# EAGLE design moshimoshi-audio-v2 (EAGLE 7.3.0)
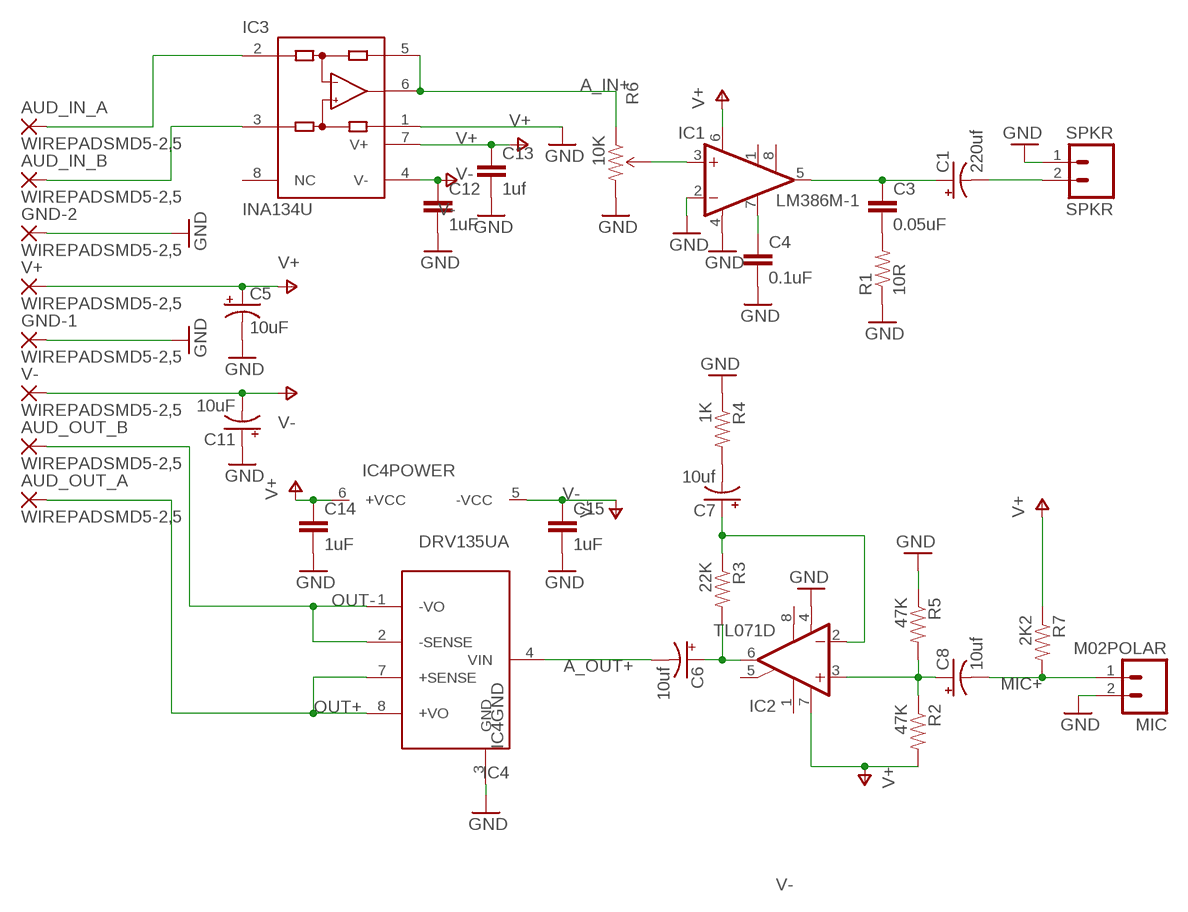
[diagram p0: schematic, sheet 1]

## Parts
AUD_IN_A  WIREPADSMD5-2,5  [5-2,5]
AUD_IN_B  WIREPADSMD5-2,5  [5-2,5]
AUD_OUT_A  WIREPADSMD5-2,5  [5-2,5]
AUD_OUT_B  WIREPADSMD5-2,5  [5-2,5]
C1  220uf  CAP_POLPTH1  [CPOL-RADIAL-100UF-25V]
C3  0.05uF  CAP0805  [0805]
C4  0.1uF  CAP0603-CAP  [0603-CAP]
C5  10uF  10UF-16V-10%(TANT)  [EIA3216]
C6  10uf  CAP_POLPTH2  [CPOL-RADIAL-10UF-25V]
C7  10uf  CAP_POLPTH2  [CPOL-RADIAL-10UF-25V]
C8  10uf  CAP_POLPTH2  [CPOL-RADIAL-10UF-25V]
C11  10uF  10UF-16V-10%(TANT)  [EIA3216]
C12  1uF  CAP0805  [0805]
C13  1uf  CAP0805  [0805]
C14  1uF  CAP0805  [0805]
C15  1uF  CAP0805  [0805]
GND-1  WIREPADSMD5-2,5  [5-2,5]
GND-2  WIREPADSMD5-2,5  [5-2,5]
IC1  LM386M-1  [SO08]
IC2  TL071D  [SO08]
IC3  INA134U  [SO08]
IC4  DRV135UA  [SO08]
MIC  M02POLAR  [MOLEX-1X2]
R1  10R  RESISTOR0805-RES  [0805]
R2  47K  RESISTOR0603-RES  [0603-RES]
R3  22K  RESISTOR0603-RES  [0603-RES]
R4  1K  RESISTOR0603-RES  [0603-RES]
R5  47K  RESISTOR0603-RES  [0603-RES]
R6  10K  TRIMPOT3MM-2  [TRIMPOT-3MM-2]
R7  2K2  RESISTOR0603-RES  [0603-RES]
SPKR  SPKR  M02POLAR  [MOLEX-1X2]
V+  WIREPADSMD5-2,5  [5-2,5]
V-  WIREPADSMD5-2,5  [5-2,5]

## Nets
A_IN+: IC3.5(SENSE) IC3.6(OUT) R6.1(CCW)
A_OUT+: C6.2(-) IC4.4(VIN)
GND: C4.2 C5.C(-) C11.A(+) C12.2 C13.2 C14.2 C15.2 GND-1.1(P) GND-2.1(P) IC1.2(-IN) IC1.4(GND) IC2.4(V-) IC3.1(REF) IC4.3(GND) MIC.2 R1.1 R4.1 R5.1 R6.3(CW) SPKR.1
IN+: AUD_IN_B.1(P) IC3.3(+IN)
IN-: AUD_IN_A.1(P) IC3.2(-IN)
MIC+: C8.2(-) MIC.1 R7.2
N$1: C1.2(-) SPKR.2
N$3: IC1.3(+IN) R6.2(WIPER)
N$4: C1.1(+) C3.1 IC1.5(OUT)
N$5: C4.1 IC1.7(BYPASS)
N$6: C3.2 R1.2
N$8: C6.1(+) IC2.6(OUT) R3.2
N$9: C7.1(+) IC2.2(-IN) R3.1
N$10: C7.2(-) R4.2
N$11: C8.1(+) IC2.3(+IN) R2.1 R5.2
OUT+: AUD_OUT_A.1(P) IC4.7(+SENSE) IC4.8(+VO)
OUT-: AUD_OUT_B.1(P) IC4.1(-VO) IC4.2(-SENSE)
V+: C5.A(+) C13.1 C14.1 IC1.6(VS) IC2.7(V+) IC3.7(V+) IC4.6(+VCC) R2.2 R7.1 V+.1(P)
V-: C11.C(-) C12.1 C15.1 IC3.4(V-) IC4.5(-VCC) V-.1(P)
Unconnected: IC1.1(GAIN) IC1.8(GAIN) IC2.1(ON1) IC2.5(ON2) IC2.8(OPT) IC3.8(NC)

## Library data of the parts
AUD_IN_A AUD_IN_B AUD_OUT_A AUD_OUT_B GND-1 GND-2 V+ V- = wirepad:WIREPAD: Wire PAD connect wire on PCB
C1 C6-C8 = SparkFun-Capacitors:CAP_POL: Capacitor Polarized These are standard SMD and PTH capacitors. Normally 10uF, 47uF, and 100uF in electrolytic and tantalum varieties. Always verify the external diameter of the through hole cap, it varies with capacity, voltage, and manufacturer. The EIA devices should be standard.
C3 C4 C12-C15 = SparkFun-Capacitors:CAP: Capacitor Standard 0603 ceramic capacitor, and 0.1" leaded capacitor.
C5 C11 = SparkFun-Capacitors:10UF-16V-10%(TANT): CAP-00811 1206/EIA-3216 Tantalum capacitor; PROD_ID: CAP-00811
IC1 = linear:LM386?-*: Low Voltage Audio Power Amplifier Source: http://cache.national.com/ds/LM/LM386.pdf
IC2 = linear:TL071: OP AMP
IC3 = burr-brown:INA134: Audio Differential Line Receivers 0dB, G=1; MPN: INA134UAE4; OC_FARNELL: 1206899; OC_NEWARK: 97K1923
IC4 = BurrBrownAudioParts:DRV135: Audio Balanced Line Drivers
MIC SPKR = SparkFun-Connectors:M02: Standard 2-pin 0.1" header. Use with - straight break away headers ( PRT-00116) - right angle break away headers (PRT-00553) - swiss pins (PRT-00743) - machine pins (PRT-00117) - female headers (PRT-00115) Molex polarized connector foot print use with: PRT-08233 with associated crimp pins and housings. 2.54_SCREWTERM for use with PRT-10571. 3.5mm Screw Terminal footprints for PRT-08084 5mm Screw Terminal footprints for use with PRT-08433
R1-R5 R7 = SparkFun-Resistors:RESISTOR: Resistor Basic schematic elements and footprints for 0603, 1206, and PTH resistors.
R6 = SparkFun-Electromechanical:TRIMPOT: Various small potentiometers for "set-and-forget" applications; PROD_ID: RES-08048

## Board
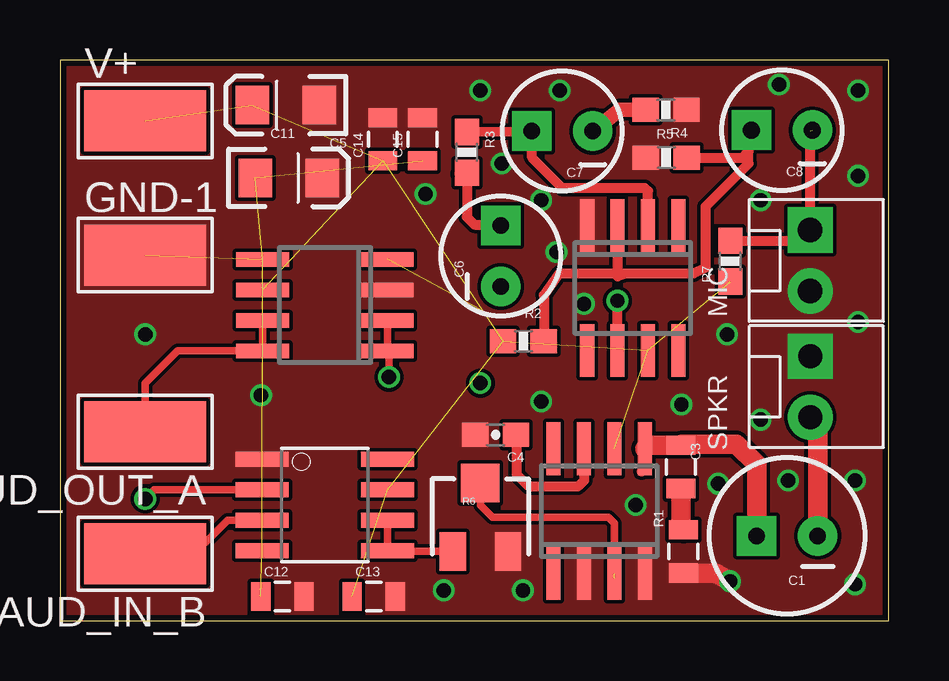
[diagram p1: board, top side]
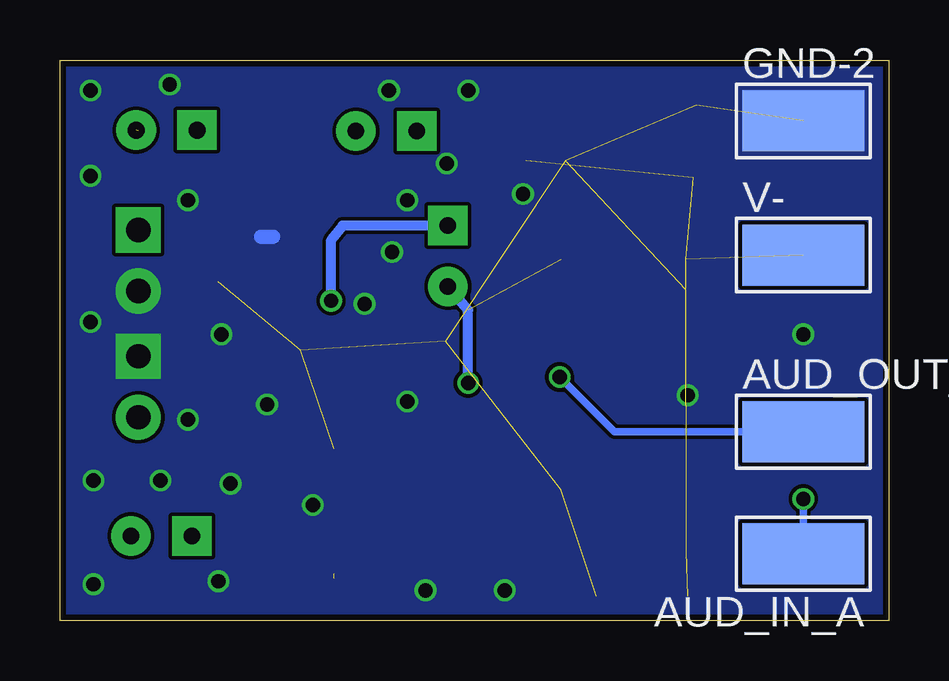
[diagram p2: board, bottom side, seen from below]

Size 34.54 x 23.37 mm. Coordinates in mm from the lower left corner, seen from the top.
Outline: 0,0 34.54,0 34.54,23.37 0,23.37 0,0
Copper layers (1*16): Top 0.035mm / dielectric 1.5mm / Bottom 0.035mm
Design rules "SeeedStudio_2layer_DRU_no_angle_20140221": minimum track width 6mil, minimum drill 12mil, track to track 6mil, track to pad 6mil, pad to pad 6mil, via to via 6mil, smd to smd 0mil, copper to edge 10mil, drill to drill 10mil, minimum pad ring 10mil, minimum via ring 6mil, stop-mask expansion 2mil, vias tented up to drill 100mil, thermal gap 10mil

### Footprints (pad centres in the part's own frame; a part is rotated, then mirrored left to right if it is on the bottom)
5-2,5 = smd 2.54 x 5.08: 1 0,0
CPOL-RADIAL-100UF-25V = drill 0.7 pad 1.651 square: 1 1.27,0 | drill 0.7 pad 1.651: 2 -1.27,0
0805 = smd 0.8 x 1.2: 1 -0.9,0; 2 0.9,0
0603-CAP = smd 1.1 x 1: 1 -0.85,0; 2 0.85,0
EIA3216 = smd 1.4 x 1.6: A 1.4,0; C -1.4,0
CPOL-RADIAL-10UF-25V = drill 0.7 pad 1.651 square: 1 1.27,0 | drill 0.7 pad 1.651: 2 -1.27,0
SO08 = smd 0.6 x 2.2: 1 -1.905,-2.6; 2 -0.635,-2.6; 3 0.635,-2.6; 4 1.905,-2.6; 5 1.905,2.6; 6 0.635,2.6; 7 -0.635,2.6; 8 -1.905,2.6
SO08' = smd 0.61 x 2.21: 1 -1.905,-2.616; 2 -0.635,-2.616; 3 0.635,-2.616; 4 1.905,-2.616; 5 1.905,2.616; 6 0.635,2.616; 7 -0.635,2.616; 8 -1.905,2.616
MOLEX-1X2 = drill 1.016 pad 1.88 square: 1 0,0 | drill 1.016 pad 1.88: 2 2.54,0
0603-RES = smd 1.1 x 1: 1 -0.85,0; 2 0.85,0
TRIMPOT-3MM-2 = smd 1.092 x 1.6: 1 -1.155,-1.421; 3 1.155,-1.421 | smd 1.6 x 1.6: 2 0,1.421

### Placement (x,y rotation side)
AUD_IN_A  3.56,2.79 90 bottom
AUD_IN_B  3.56,2.79 90 top
AUD_OUT_A  3.56,7.87 90 top
AUD_OUT_B  3.56,7.87 270 bottom
C1  30.31,3.54 180 top
C3  25.88,6.42 270 top
C4  18.16,7.75 180 top
C5  9.41,21.49 180 top
C6  18.37,15.2 90 top
C7  20.94,20.41 180 top
C8  30.1,20.45 180 top
C11  9.54,18.46 0 top
C12  9.27,1.02 0 top
C13  13.08,1.02 0 top
C14  13.46,20.07 90 top
C15  15.11,20.07 90 top
GND-1  3.56,15.24 270 top
GND-2  3.56,20.83 270 bottom
IC1  22.48,4.57 0 top
IC2  23.88,13.86 180 top
IC3  INA134U  [SO08']  11.05,4.83 270 top
IC4  11.05,13.16 90 top
MIC  31.28,16.28 270 top
R1  25.99,2.89 90 top
R2  19.32,11.66 180 top
R3  16.96,19.52 270 top
R4  25.27,21.3 180 top
R5  25.27,19.3 0 top
R6  17.53,4.32 0 top
R7  27.94,14.99 90 top
SPKR  31.28,11.02 270 top
V+  3.56,20.83 270 top
V-  3.56,15.24 270 bottom

### Tracks (layer width: path | path; a pad name or v marks a point on that pad's centre or on a via)
A_IN+
  Top 0.305: R6.1 13.69,2.9 IC3.5 IC3.6
A_OUT+  (via drill 0.6)  (1 unrouted)
  Bottom 0.406: v17.53,9.91 17.53,12.96 C6.2
GND  (via drill 0.6)
  Top 0.813: R1.1 27.35,1.99 v27.94,1.65
  Bottom 0.61: 26.16,16 25.65,16
  other vias: 29.21,17.53 20.07,9.14 27.81,11.94 33.27,18.54 33.15,1.52 8.38,9.4 24,4.83 20.83,22.1 30.35,5.84 29.97,22.35 20.7,15.37 16,1.27 33.27,22.1 21.84,13.21 33.27,12.45 17.53,22.1 29.21,8.38 19.3,1.27 18.41,19.05 3.56,11.94 15.24,17.78 25.91,9.02 27.43,5.71 20.07,17.53 33.15,5.84
  pour Bottom (no thermals): -0.06,0.34 0.17,23.63 34.55,23.38 34.49,-0.08
  pour Top (no thermals): -0.76,23.37 -1.27,0 34.54,-0.25 34.54,23.11
IN+
  Top 0.305: AUD_IN_B.1 3.81,2.29 5.08,2.29 6.99,4.19 IC3.3 8.31,4.32
IN-  (via drill 0.6)
  Top 0.305: IC3.2 3.94,5.46 v3.56,5.08
  Bottom 0.305: v3.56,5.08 AUD_IN_A.1
MIC+  (1 unrouted)
  Top 0.305: MIC.1 31.27,16.28 31.24,16.26
  Top 0.406: 31.28,20.41 MIC.1 30.83,15.84 R7.2
N$1
  Top 0.813: C1.2 31.59,8.18 SPKR.2
N$3  (1 unrouted)
  Top 0.305: 23.11,1.78 23.11,4.06 22.86,4.32 18.03,4.32 17.53,4.83 R6.2
N$4
  Top 0.406: IC1.5 24.26,6.22
  Top 0.813: C1.1 29.05,6.51 28.19,7.37 25.93,7.37 C3.1 24.53,7.32 IC1.5
N$5
  Top 0.406: 21.84,7.87 IC1.7 21.84,5.84 21.59,5.59 19.56,5.59 19.05,6.1 19.05,7.71 C4.1
N$6
  Top 0.813: C3.2 25.88,3.9 R1.2
N$8  (via drill 0.6)
  Top 0.406: IC2.6 v23.24,13.34 | R3.2 16.96,16.82 17.27,16.51 18.34,16.51 C6.1
  Top 0.61: R3.2 16.73,18.62
  Bottom 0.406: v23.24,13.34 23.24,15.88 22.77,16.47 C6.1
N$9
  Top 0.406: R3.1 C7.1 19.68,19.3 20.95,18.03 24.38,18.03 24.51,17.91 IC2.2
N$10
  Top 0.61: R4.2 23.35,21.3 C7.2
N$11
  Top 0.406: 23.62,14.48 20.83,14.48 20.17,13.57 R2.1 | 23.62,14.48 26.42,14.48 26.92,14.73 26.92,17.27 28.7,19.05 28.7,19.56 | IC2.3 23.24,14.35 23.62,14.48 | 28.7,19.56 28.7,20.32 C8.1 | R5.2 28.45,19.3 28.7,19.56
OUT+
  Top 0.305: AUD_OUT_A.1 3.56,9.91 4.9,11.25 IC4.8 IC4.7
OUT-  (via drill 0.6)
  Top 0.305: v13.72,10.16 13.72,11.18 IC4.1 IC4.2
  Bottom 0.305: AUD_OUT_B.1 11.43,7.87 v13.72,10.16
V+  (9 unrouted)
V-  (5 unrouted)

### Text on the board
tPlace: Moshi Moshi / Rev 3 | MIC | SPKR